# EAGLE design HeatBedRelay5d (EAGLE 8.2.2)
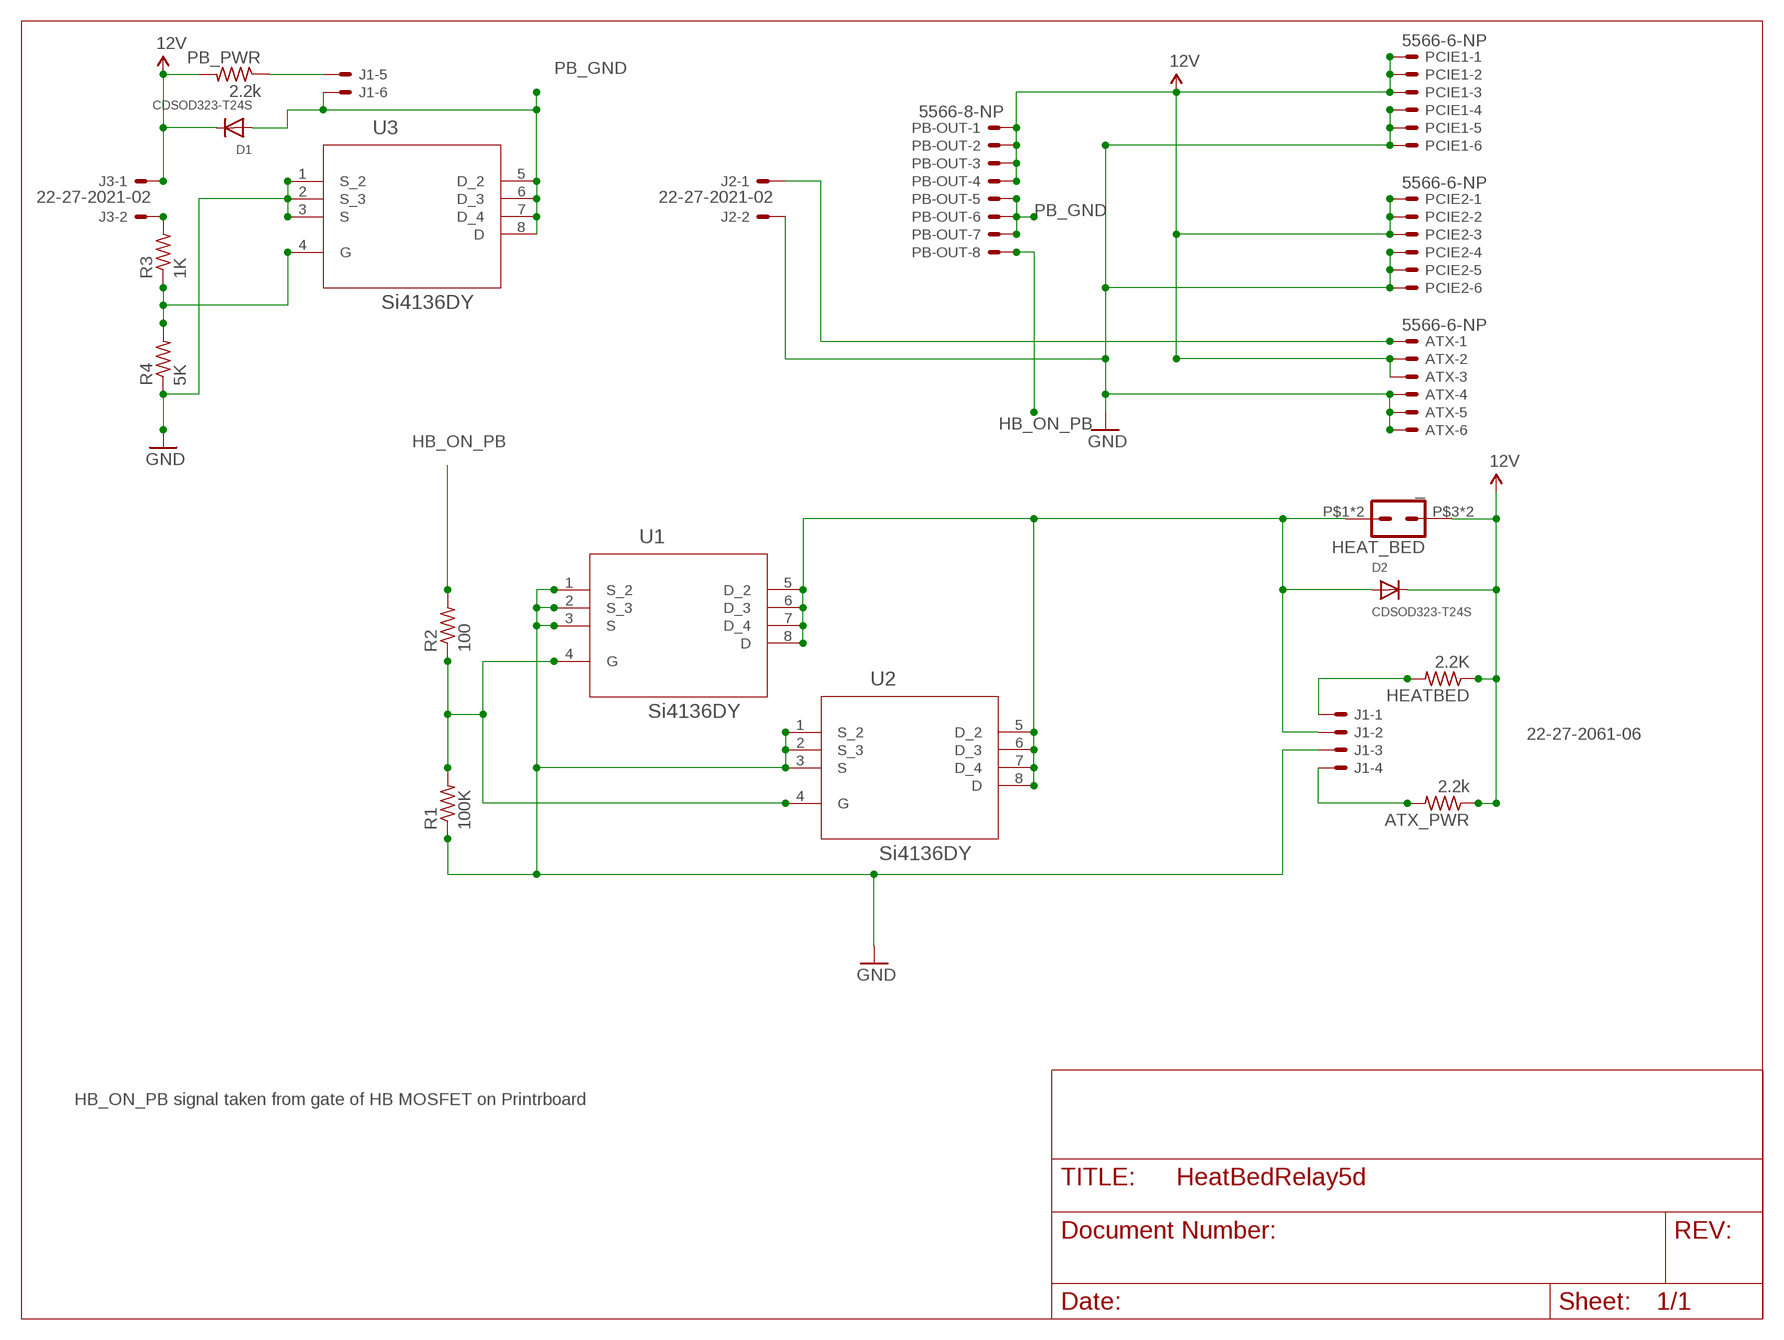
[diagram p0: schematic, sheet 1]

## Parts
ATX  5566-6-NP  [5566-6-NP]
ATX_PWR  2.2k  R-US_M1206  [M1206]
D1  CDSOD323-T24S  DIODESOD-323F  [SOD-323F]
D2  CDSOD323-T24S  DIODESOD-323F  [SOD-323F]
HEAT_BED  _  MOLEX_42820-2212  [MOLEX_42820-2212]
HEATBED  2.2K  R-US_M1206  [M1206]
J1  22-27-2061-06  [6410-06]
J2  22-27-2021-02  [6410-02]
J3  22-27-2021-02  [6410-02]
PB-OUT  5566-8-NP  [5566-8-NP]
PB_PWR  2.2k  R-US_M1206  [M1206]
PCIE1  5566-6-NP  [5566-6-NP]
PCIE2  5566-6-NP  [5566-6-NP]
R1  100K  R-US_M1206  [M1206]
R2  100  R-US_M1206  [M1206]
R3  1K  R-US_M1206  [M1206]
R4  5K  R-US_M1206  [M1206]
U1  Si4136DY  IRL6342PBF  [SOIC127P600X175-8N]
U2  Si4136DY  IRL6342PBF  [SOIC127P600X175-8N]
U3  Si4136DY  IRL6342PBF  [SOIC127P600X175-8N]

## Nets
12V: ATX.2 ATX.3 ATX_PWR.1 D1.C D2.C HEAT_BED.P$3 HEAT_BED.P$4 HEATBED.1 J3.1 PB-OUT.1 PB-OUT.2 PB-OUT.3 PB-OUT.4 PB_PWR.2 PCIE1.1 PCIE1.2 PCIE1.3 PCIE2.1 PCIE2.2 PCIE2.3
GND: ATX.4 ATX.5 ATX.6 J1.3 J2.2 PCIE1.4 PCIE1.5 PCIE1.6 PCIE2.4 PCIE2.5 PCIE2.6 R1.1 R4.1 U1.1(S_2) U1.2(S_3) U1.3(S) U2.1(S_2) U2.2(S_3) U2.3(S) U3.1(S_2) U3.2(S_3) U3.3(S)
HB_DRAIN: D2.A HEAT_BED.P$1 HEAT_BED.P$2 J1.2 U1.5(D_2) U1.6(D_3) U1.7(D_4) U1.8(D) U2.5(D_2) U2.6(D_3) U2.7(D_4) U2.8(D)
HB_ON_PB: PB-OUT.8 R2.2
N$1: ATX.1 J2.1
N$2: HEATBED.2 J1.1
N$3: ATX_PWR.2 J1.4
N$4: R1.2 R2.1 U1.4(G) U2.4(G)
N$5: J3.2 R3.2
N$6: R3.1 R4.2 U3.4(G)
N$7: J1.5 PB_PWR.1
PB_GND: D1.A J1.6 PB-OUT.5 PB-OUT.6 PB-OUT.7 U3.5(D_2) U3.6(D_3) U3.7(D_4) U3.8(D)

## Notes on the sheet
- HB_ON_PB signal taken from gate of HB MOSFET on Printrboard

## Library data of the parts
ATX PCIE1 PCIE2 = Shipman:5566-6-NP: Mini FIT connector 6 pol Source: http://www.molex.com
ATX_PWR HEATBED PB_PWR R1-R4 = Shipman:R-US_: RESISTOR, American symbol
D1 D2 = adafruit:DIODE: Diode SMADIODE - SMA Surface Mount Package 20V 1A Schottky Diode Digikey: 641-1014-6-ND DO-1N4148 - Through Hole Small Current Diode SOD-123 20V 1 A (.5mV Vf) Schottky Diode - Digikey: MBRX120TPMSCT-ND SOD-323 10V 570mA (.38mV Vf, 3ns) Schottky Diode - Digikey: ZLLS410CT-ND SOD-523 30V 30mA Schottky Diode (RB751S-40TE61) - Digikey: RB751S-40TE61CT-ND SOT23-R/W - SOT23 Package (R = Solder Paste/Reflow Ovens, W = Hand-Soldering) BAT54Film 40V 300mA - Digikey: 497-7162-1-ND
HEAT_BED = Shipman:MOLEX_42820-2212: Molex Mini-Fit Sr. 42820-2212 2-Position Right Angle socket
J1 = Shipman:22-?-06: CONNECTOR wire to board 2.54 mm (.1 inch) pitch header; OC_FARNELL: unknown; OC_NEWARK: unknown
J2 J3 = Shipman:22-?-02: CONNECTOR wire to board 2.54 mm (.1 inch) pitch header; OC_FARNELL: unknown; OC_NEWARK: unknown
PB-OUT = Shipman:5566-8-NP: Mini FIT connector 8 pol Source: http://www.molex.com
U1-U3 = International_Rectifier_By_element14_Batch_1:IRL6342PBF: HEXFETPower MOSFET; MPN: IRL6342PBF; OC_FARNELL: 1890091; OC_NEWARK: 25T5535; PACKAGE: SOIC-8; SUPPLIER: INTERNATIONALRECTIFIER

## Board
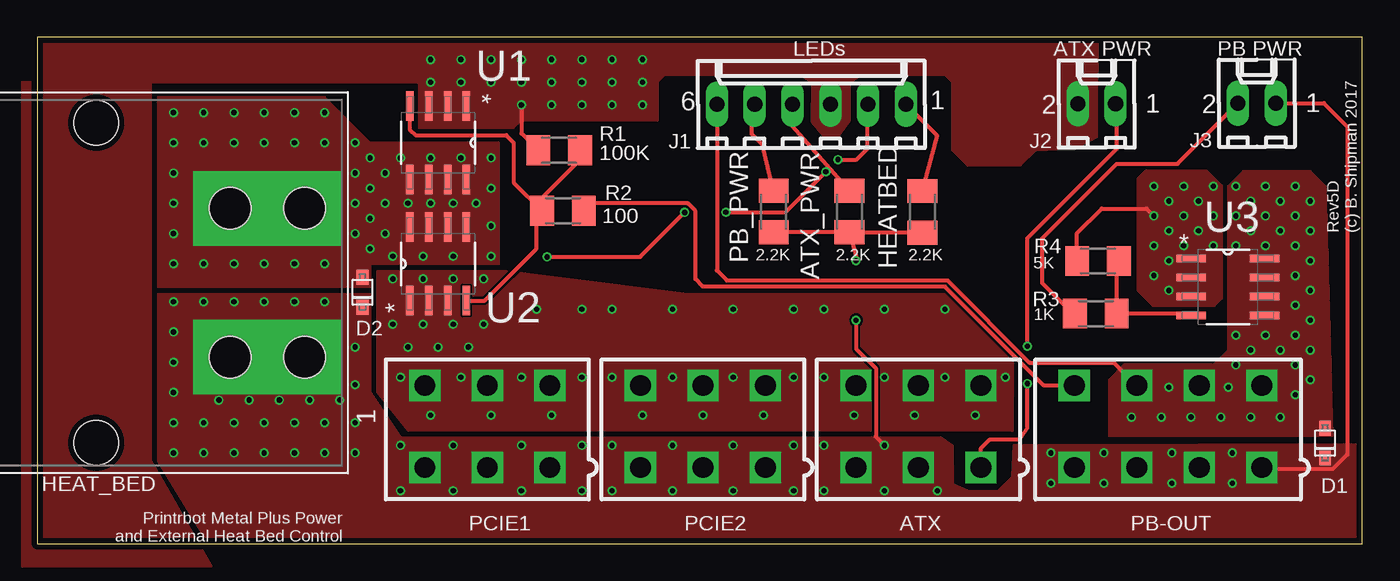
[diagram p1: board, top side]
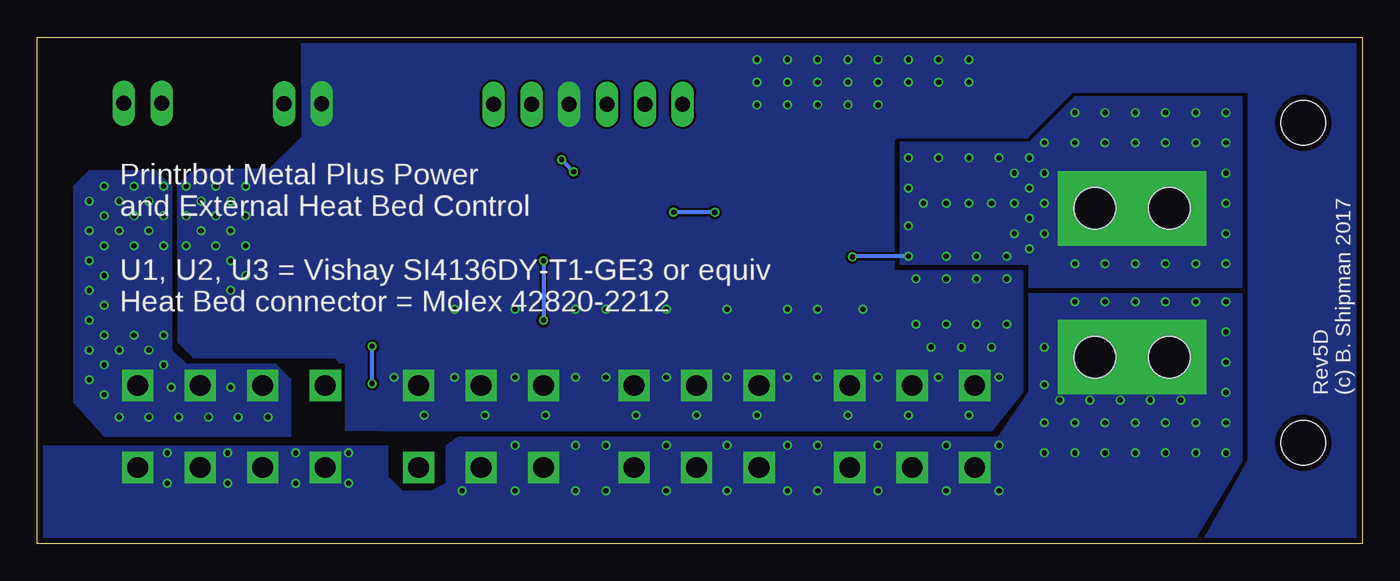
[diagram p2: board, bottom side, seen from below]

Size 89 x 34 mm. Coordinates in mm from the lower left corner, seen from the top.
Outline: 0,0 89,0 89,34 0,34 0,0
Copper layers (1*16): Top 0.035559375mm / dielectric 1.6mm / Bottom 0.035559375mm
Design rules "oshpark-2layer *": minimum track width 6mil, minimum drill 10mil, track to track 6mil, track to pad 6mil, pad to pad 6mil, via to via 6mil, smd to smd 6mil, copper to edge 15mil, drill to drill 6mil, minimum pad ring 5mil, minimum via ring 5mil, stop-mask expansion 2.5mil, vias tented up to drill 15mil, thermal gap 10mil

### Footprints (pad centres in the part's own frame; a part is rotated, then mirrored left to right if it is on the bottom)
5566-6-NP = drill 1.4 square: 1 4.2,-2.75; 2 0,-2.75; 3 -4.2,-2.75; 4 4.2,2.75; 5 0,2.75; 6 -4.2,2.75
M1206 = smd 1.6 x 2: 1 -1.4,0; 2 1.4,0
SOD-323F = smd 1 x 0.8: A -1,0; C 1,0
MOLEX_42820-2212 = drill 2.8 pad 5 square: P$1 -5,5; P$2 -5,0; P$3 5,0; P$4 5,5 | hole 2.8: 5,0; 5,5; -5,5; -5,0 | hole 3: 10.75,-9; -10.75,-9
6410-06 = drill 1.016 long: 1 6.35,0; 2 3.81,0; 3 1.27,0; 4 -1.27,0; 5 -3.81,0; 6 -6.35,0
6410-02 = drill 1.016 long: 1 1.27,0; 2 -1.27,0
5566-8-NP = drill 1.4 square: 1 6.3,-2.75; 2 2.1,-2.75; 3 -2.1,-2.75; 4 -6.3,-2.75; 5 6.3,2.75; 6 2.1,2.75; 7 -2.1,2.75; 8 -6.3,2.75
SOIC127P600X175-8N = smd 1.981 x 0.508: 1 -2.464,1.905; 2 -2.464,0.635; 3 -2.464,-0.635; 4 -2.464,-1.905; 5 2.464,-1.905; 6 2.464,-0.635; 7 2.464,0.635; 8 2.464,1.905

### Placement (x,y rotation side)
ATX  59.19,7.87 0 top
ATX_PWR  54.55,22.3 90 top
D1  86.5,6.75 270 top
D2  21.85,16.88 270 top
HEAT_BED  12.96,17.52 270 top
HEATBED  59.46,22.27 90 top
J1  52,29.5 0 top
J2  71.16,29.53 0 top
J3  81.92,29.57 0 top
PB-OUT  75.95,7.87 0 top
PB_PWR  49.47,22.3 270 top
PCIE1  30.23,7.87 0 top
PCIE2  44.71,7.87 0 top
R1  35.06,26.41 0 top
R2  35.31,22.34 0 top
R3  71.1,15.45 180 top
R4  71.25,18.98 0 top
U1  26.93,26.92 270 top
U2  26.93,18.79 90 top
U3  79.97,17.24 0 top

### Tracks (layer width: path | path; a pad name or v marks a point on that pad's centre or on a via)
12V  (via drill 0.35)
  Top 0.254: HEATBED.1 55.08,20.87 ATX_PWR.1 | ATX_PWR.1 PB_PWR.2 | J3.1 86.43,29.57 88,28 88,6 87,5 82.37,5 PB-OUT.1 | ATX_PWR.1 55.05,19.05 v55,19 | v55,15 55,13.1 56.32,11.78 56.32,7.18 v56.9,6.6
  Bottom 0.254: v55,19 v55,15
  other vias: 19.31,16.25 17.28,16.25 15.25,16.25 13.21,16.25 11.18,16.25 9.15,16.25 9.15,14.22 9.15,12.18 9.15,10.15 9.15,8.12 9.15,6.09 11.18,8.12 13.21,8.12 15.25,8.12 17.28,8.12 19.31,8.12 18.29,9.64 16.26,9.64 14.23,9.64 12.2,9.64 20.33,9.64 21.34,8.12 21.34,10.66 21.34,13.2 11.18,6.09 13.21,6.09 15.25,6.09 17.28,6.09 19.31,6.09 21.34,6.09 24.39,6.6 24.39,3.55 27.95,6.6 27.95,3.55 32.52,6.6 32.52,3.55 36.58,6.6 36.58,3.55 38.62,6.6 42.68,6.6 46.74,6.6 50.81,6.6 50.81,3.55 46.74,3.55 42.68,3.55 38.62,3.55 52.84,6.6 52.84,3.55 56.9,3.55 60.46,3.55 80.27,4.06 80.27,6.09 76.21,6.09 76.21,4.06 71.63,6.09 71.63,4.06 68.08,6.09 68.08,4.06
  pour Top (no thermals): 8.13,16.76 8.13,5.58 12.45,-1.53 90.7,-1.03 90.74,3.17 90.61,3.04 90.38,6.67 65.6,6.6 65.5,4.5 64.48,3.53 62.48,3.54 61.48,3.98 61.5,4 61.48,6.58 60.7,7.1 24.39,7.1 22.36,10.15 22.36,16.76
  pour Bottom (no thermals): 8.13,16.76 8.13,5.58 11.95,-0.77 59.7,-0.77 90.5,-0.5 90.5,6.5 65.5,6.5 65.5,4.5 64.5,3.5 62.5,3.5 61.48,4.04 61.48,6.58 60.7,7.1 24.39,7.1 22.36,10.15 22.36,16.76
GND  (via drill 0.35)
  Top 0.254: v32.52,29.46 32.52,27.55 R1.1 | R4.1 69.85,20.85 71.5,22.5 74.5,22.5 v75,22
  other vias: 26.42,30.98 28.45,30.98 28.45,32.5 26.42,32.5 30.49,32.5 30.49,30.98 32.52,30.98 32.52,32.5 34.55,32.5 36.58,32.5 38.62,32.5 34.55,30.98 36.58,30.98 38.62,30.98 38.62,29.46 36.58,29.46 34.55,29.46 40.65,32.5 40.65,30.98 40.65,29.46 29.98,17.77 27.95,17.77 25.91,17.77 23.88,17.77 23.88,14.72 24.9,13.2 25.91,14.72 27.95,14.72 29.98,14.72 28.96,13.2 26.93,13.2 32.52,11.17 24.39,11.17 28.45,11.17 26.42,8.63 30.49,8.63 34.55,8.63 40.65,8.63 44.71,8.63 48.78,8.63 54.87,8.63 58.94,8.63 63,8.63 36.58,11.17 38.62,11.17 42.68,11.17 46.74,11.17 50.81,11.17 52.84,11.17 56.9,11.17 60.97,11.17 65.03,11.17 60.97,15.74 52.84,15.74 46.74,15.74 56.9,15.74 50.81,15.74 36.58,15.74 38.62,15.74 42.68,15.74 33.54,15.74 77,24 77,22 79,22 78,21 75,20 75,18 76,17 76,19 76,23 75,24 77,20 79,20 76,21 78,23 79,24
  pour Top (no thermals): 22.87,18.28 22.87,10.15 24.9,7.61 65.49,7.58 65.54,12.18 60.97,16.76 43.7,16.76 31.5,18.28
  pour Bottom (no thermals): 11.18,-0.77 -0.25,-0.77 -0.25,34.28 71.19,34.28 71.19,27.32 73.41,25.1 78.4,25.1 79.52,24.1 79.51,13.72 79.51,13.51 78.5,12.5 69,12.5 68.67,12.18 68.25,12.18 68.25,7.64 65.72,7.61 24.9,7.61 22.87,10.15 22.87,18.28 31.5,18.28 31.5,27.04 31.25,27.3 22.49,27.3 19.44,30.34 7.63,30.34 7.63,5.58
  pour Top (no thermals): 71.2,35.04 71.17,27.31 69.62,26.49 69.57,26.49 68.56,26.48 67.06,26.41 66.05,25.39 62.49,25.39 61.48,26.41 61.48,30.98 60.97,31.49 55.36,31.49 54.55,30.96 54.55,28.39 53.83,27.39 52.8,27.39 52.03,28.34 52.08,30.94 51.28,31.49 42.17,31.49 41.66,30.98 41.66,28.44 32.52,28.44 32.01,27.93 25.66,27.93 25.66,30.98 -1.01,30.98 -1.01,35.04
  pour Top (no thermals): 11.69,-1.53 7.63,5.58 7.63,30.98 -1.01,30.98 -1.01,-1.53
  pour Top (no thermals): 79.5,24 79.5,16.5 79,16 75,16 74,17 74,24.5 74.5,25 78.5,25
HB_DRAIN  (via drill 0.35)
  Top 0.254: v34.25,19.25 40.5,19.25 v43.49,22.24 | v46.25,22.25 50.25,22.25 v52.96,24.96 | v53.79,25.79 55.04,25.79 55.75,26.5 55.75,29.44 J1.2
  Bottom 0.254: v30.49,19.3 34.2,19.3 v34.25,19.25 | v43.49,22.24 46.24,22.24 v46.25,22.25 | v52.96,24.96 v53.79,25.79
  other vias: 9.15,28.95 11.18,28.95 13.21,28.95 15.25,28.95 17.28,28.95 19.31,28.95 19.31,26.92 30.49,21.33 30.49,23.87 30.49,25.9 28.45,25.9 26.42,25.9 24.39,25.9 22.36,25.9 21.34,26.92 17.28,26.92 15.25,26.92 13.21,26.92 11.18,26.92 9.15,26.92 9.15,24.88 9.15,22.85 9.15,20.82 9.15,18.79 11.18,18.79 13.21,18.79 15.25,18.79 17.28,18.79 19.31,18.79 22.36,19.8 21.34,20.82 22.36,21.84 21.34,22.85 22.36,23.87 21.34,24.88 23.38,24.88 23.38,22.85 24.9,22.85 26.42,22.85 27.95,22.85 29.47,22.85 23.38,20.82 23.88,19.3 25.91,19.3 27.95,19.3
  pour Top (no thermals): 8.13,17.26 8.13,29.96 19.31,29.96 22.36,26.92 30.99,26.92 30.99,18.79 22.36,18.79 22.36,17.26
  pour Bottom (no thermals): 30.99,26.92 22.36,26.92 19.31,29.96 8.13,29.96 8.13,17.26 22.36,17.26 22.36,18.79 30.99,18.79
HB_ON_PB
  Top 0.254: R2.2 37.22,22.85 43.7,22.85 44.2,22.34 44.2,17.77 44.71,17.26 60.97,17.26 67.61,10.62 PB-OUT.8
N$1  (via drill 0.35)
  Top 0.254: ATX.1 63.39,6.39 64,7 66,7 66.5,7.75 v66.5,10.75 | v66.5,13.25 66.5,20.5 72.5,26.5 72.5,29.46 J2.1
  Bottom 0.254: v66.5,10.75 v66.5,13.25
N$2
  Top 0.254: HEATBED.2 60.46,27.39 J1.1
N$3
  Top 0.254: ATX_PWR.2 50.73,28.02 J1.4
N$4
  Top 0.254: U2.4 30.05,16.32 33.54,19.8 33.54,21.97 R2.1 | R2.1 33.91,23.23 36.58,25.9 36.58,26.28 R1.2 | U1.4 25.03,27.8 25.41,27.42 31.5,27.42 32.01,26.92 32.01,24.25 R2.1
N$5
  Top 0.254: R3.2 69.55,15.45 67.5,17.5 67.5,20.5 72.5,25.5 76.58,25.5 J3.2
N$6
  Top 0.254: U3.4 77.39,15.45 R3.1 72.5,18.83 R4.2
N$7
  Top 0.254: PB_PWR.1 48.72,26.78 48,27.5 48,29.31 J1.5
PB_GND  (via drill 0.35)
  Top 0.254: J1.6 45.65,18.35 46.33,17.67 61.14,17.67 66.65,12.15 72.32,12.15 PB-OUT.7
  other vias: 80.5,24 82.5,24 84.5,24 81.5,23 83.5,23 85.5,23 84.5,22 82.5,22 80.5,22 81.5,21 83.5,21 85.5,21 84.5,20 82.5,20 80.5,20 85.5,19 84.5,18 85.5,17 84.5,16 85.5,15 84.5,14 82.5,14 80.5,14 80.5,12 81.5,13 83.5,13 85.5,13 84.5,12 85.5,11 84.5,10 83.5,8.5 81.5,8.5 79.5,8.5 77.5,8.5 75.5,8.5 73.5,8.5 76,10.5 80,10.5
  pour Bottom (no thermals): 72,7.25 72,11 73,12 79,12 80,13 80,24 81,25 85.5,25 86.5,24 86.5,9.5 84.5,7.25
  pour Top (no thermals): 80,24 81,25 85.5,25 86.5,24 87,7.25 72,7.25 72,11 73,12 79,12 80,13

### Text on the board
tPlace: Rev5D / (c) B. Shipman 2017 | Printrbot Metal Plus Power / and External Heat Bed Control
tNames: LEDs | ATX PWR | PB PWR | 100K | 100 | 2.2K | 2.2K | 2.2K | 5K | 1K
bNames: Printrbot Metal Plus Power / and External Heat Bed Control / / U1, U2, U3 = Vishay SI4136DY-T1-GE3 or equiv / Heat Bed connector = Molex 42820-2212 | Rev5D / (c) B. Shipman 2017